# Altium project Cellar Watchdog.PrjPcb (part 4 of 4)

## Sheet Ethernet Controller.SchDoc: Ethernet Controller
size A3; Date: Dec. 29th, 2022; Author: Karl Asseily; DrawnBy: Karl Asseily; DocumentNumber: 202301222126; Revision: 1.2; SheetNumber: 17; SheetTotal: 20; Time: 23:00
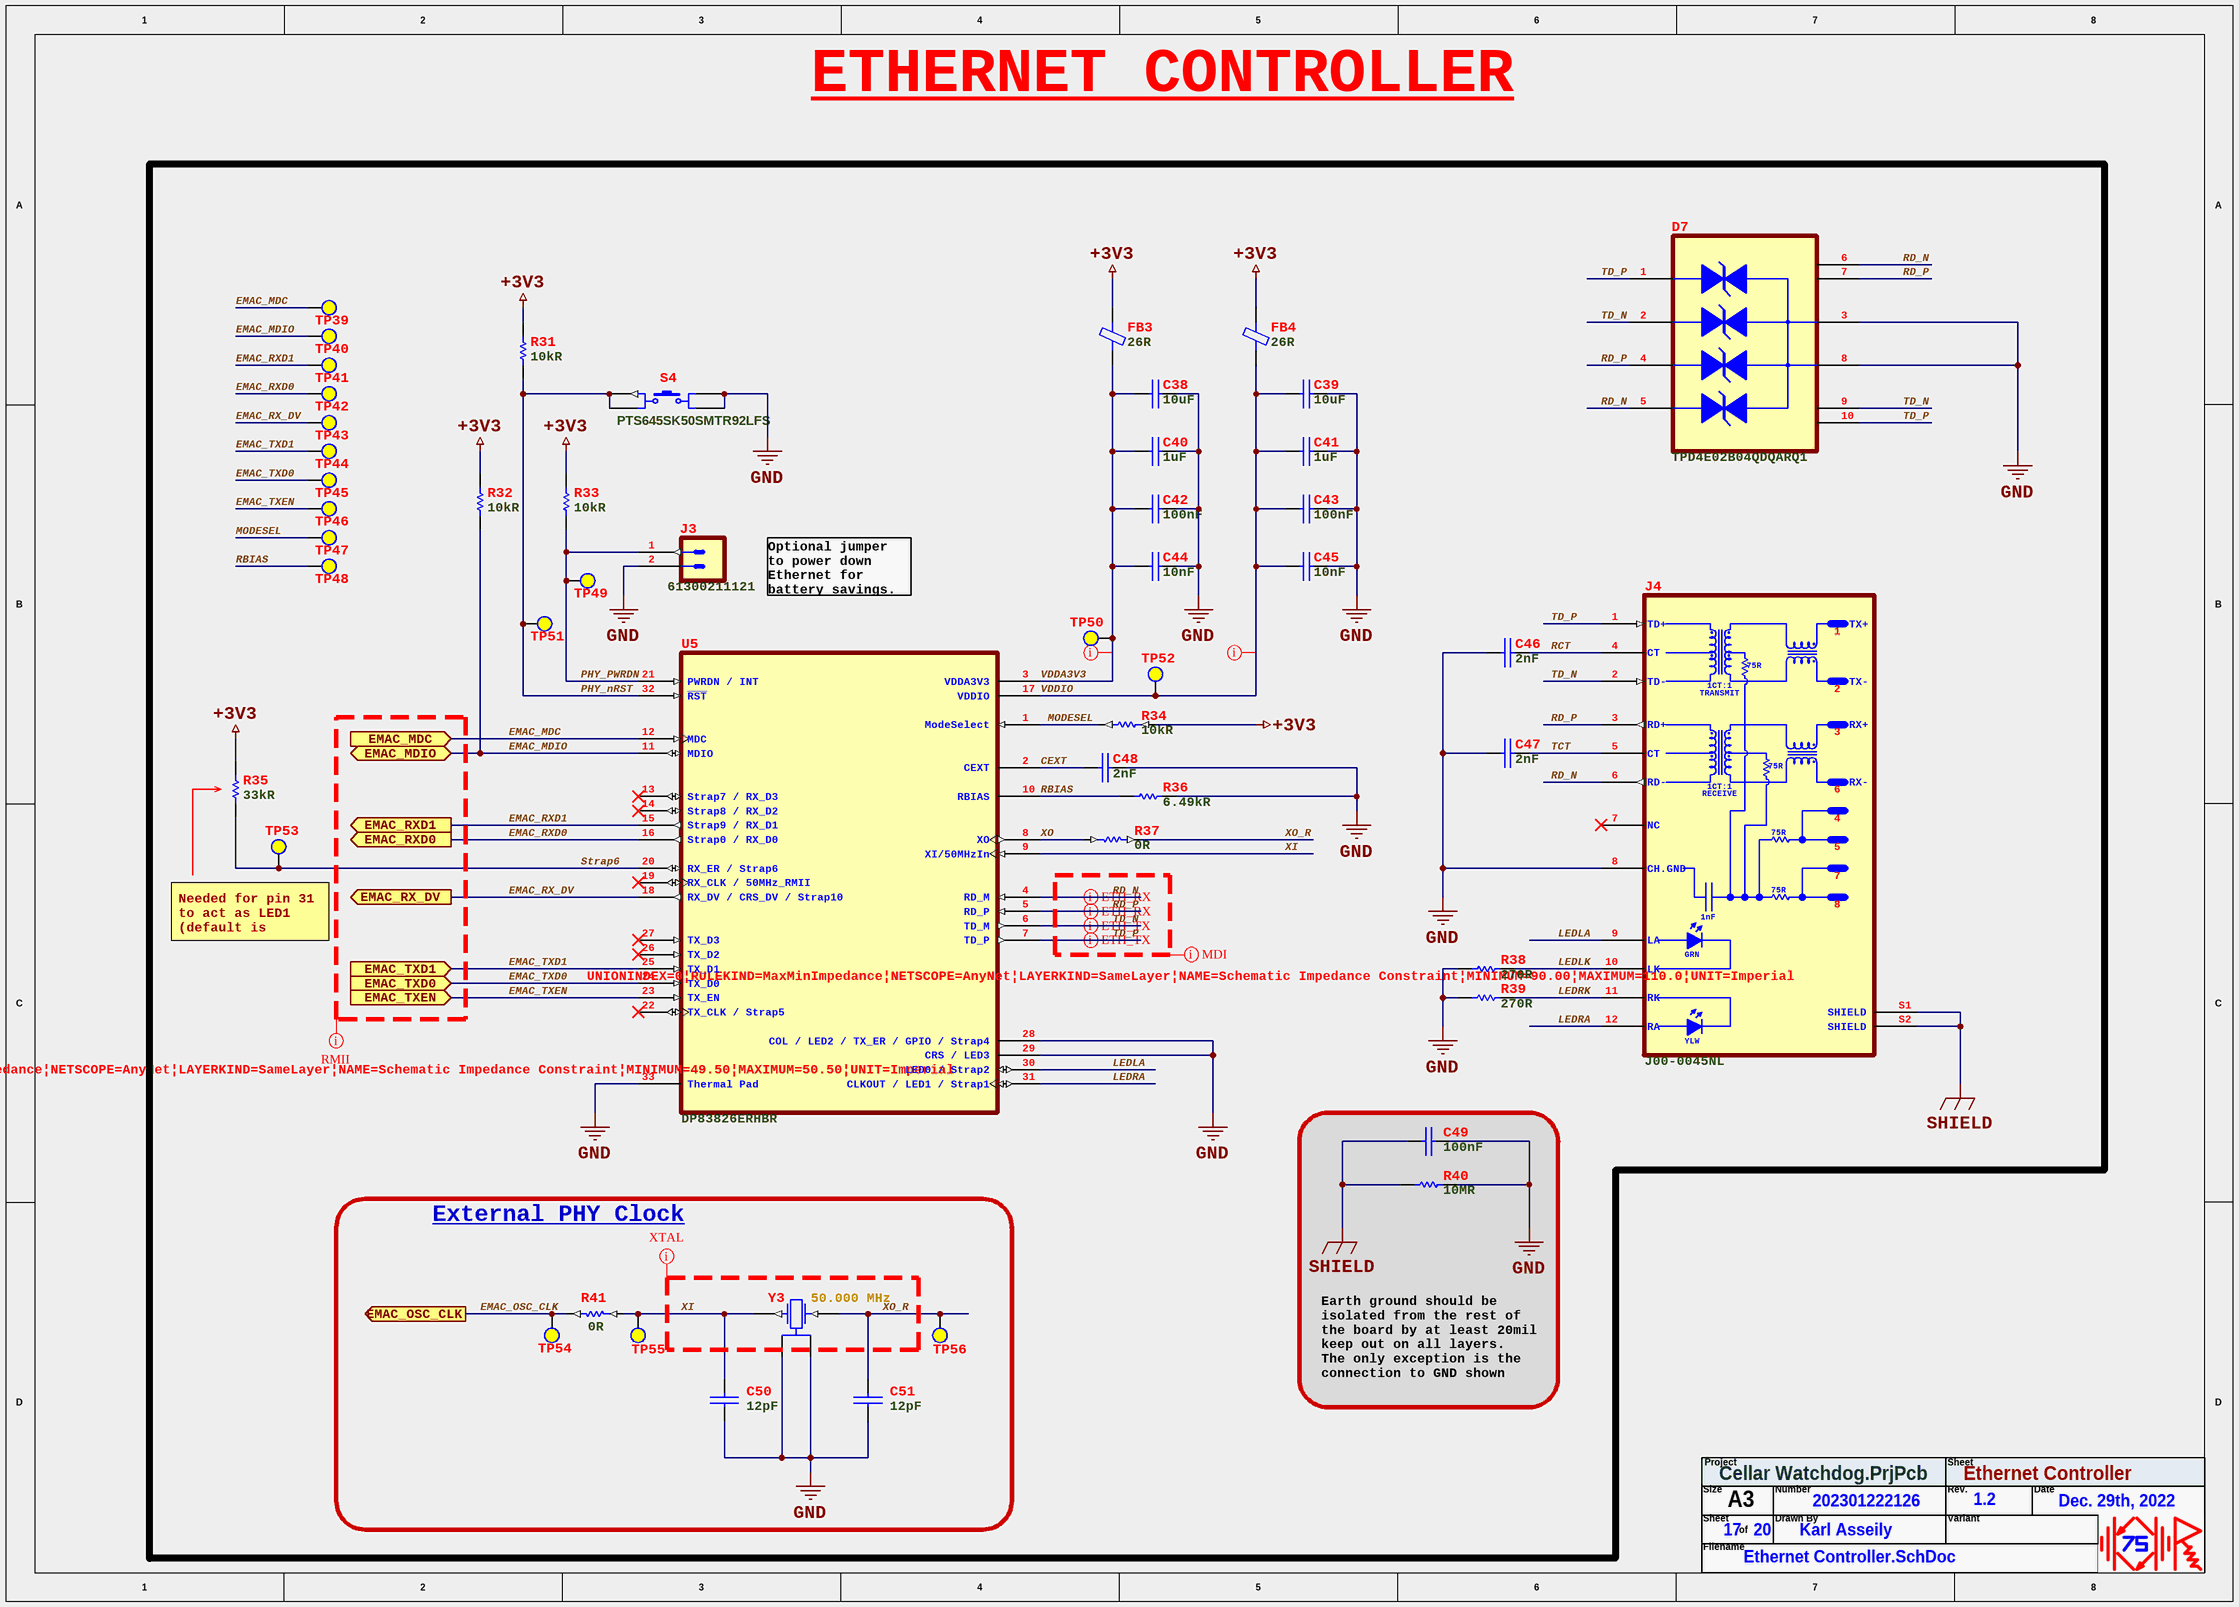
[diagram p18: Ethernet Controller.SchDoc]

### Parts
C38  10uF  [CAP_1206]
C39  10uF  [CAP_1206]
C40  1uF  [CAP_0805]
C41  1uF  [CAP_0805]
C42  100nF  [CAP_0603]
C43  100nF  [CAP_0603]
C44  10nF  [CAP_0603]
C45  10nF  [CAP_0603]
C46  2nF  [CAP_0603]
C47  2nF  [CAP_0603]
C48  2nF  [CAP_0603]
C49  100nF  [CAP_1206]
C50  12pF  [CAP_0603]
C51  12pF  [CAP_0603]
D7  TPD4E02B04QDQARQ1  [DIO-T-A_10-USON]
FB3  26R  [FB_0603]
FB4  26R  [FB_0603]
J3  61300211121  [CON_PLG_HDR-2x1-100]
J4  J00-0045NL  [CON-RCPT_RJ_PULSE_J00-0045NL]
R31  10kR  [RES_0603]
R32  10kR  [RES_0603]
R33  10kR  [RES_0603]
R34  10kR  [RES_0603]
R35  33kR  [RES_0603]
R36  6.49kR  [RES_0603]
R37  0R  [RES_0603]
R38  270R  [RES_0603]
R39  270R  [RES_0603]
R40  10MR  [RES_2512]
R41  0R  [RES_0603]
S4  PTS645SK50SMTR92LFS  [SW_TACTILE-SPST_PTS645SK50SMTR92LFS_SMD]
TP39  EMAC_MDC  [TEST POINT PAD]  (value not drawn)  (no BOM)
TP40  EMAC_MDIO  [TEST POINT PAD]  (value not drawn)  (no BOM)
TP41  EMAC_RXD1  [TEST POINT PAD]  (value not drawn)  (no BOM)
TP42  EMAC_RXD0  [TEST POINT PAD]  (value not drawn)  (no BOM)
TP43  EMAC_RX_DV  [TEST POINT PAD]  (value not drawn)  (no BOM)
TP44  EMAC_TXD1  [TEST POINT PAD]  (value not drawn)  (no BOM)
TP45  EMAC_TXD0  [TEST POINT PAD]  (value not drawn)  (no BOM)
TP46  EMAC_TXEN  [TEST POINT PAD]  (value not drawn)  (no BOM)
TP47  MODESEL  [TEST POINT PAD]  (value not drawn)  (no BOM)
TP48  RBIAS  [TEST POINT PAD]  (value not drawn)  (no BOM)
TP49  PHY_PWRDN  [TEST POINT PAD]  (value not drawn)  (no BOM)
TP50  VDDA3V3  [TEST POINT PAD]  (value not drawn)  (no BOM)
TP51  PHY_nRST  [TEST POINT HOLE]  (value not drawn)  (no BOM)
TP52  VDDIO  [TEST POINT PAD]  (value not drawn)  (no BOM)
TP53  Strap6  [TEST POINT PAD]  (value not drawn)  (no BOM)
TP54  EMAC_OSC_CLK  [TEST POINT PAD]  (value not drawn)  (no BOM)
TP55  50MHz IN EMAC  [TEST POINT HOLE]  (value not drawn)  (no BOM)
TP56  50MHz OUT EMAC  [TEST POINT HOLE]  (value not drawn)  (no BOM)
U5  DP83826ERHBR  [IC_QFN50P500X500X100-33N-D]
Y3  Frequency: 50.000 MHz  [XTAL_ECS-500-10-33-RTN-TR]  (hidden comment: ECS-500-10-33-RTN-TR)

### Blocks framed on the sheet
External PHY Clock: C50 C51 R41 TP54-TP56 Y3

### Ports
EMAC_MDC (in, see Cellar Watchdog, ESP32 Processor, Main Controller Unit), EMAC_MDIO (bidir, see Cellar Watchdog, ESP32 Processor, Main Controller Unit), EMAC_OSC_CLK (out, see Cellar Watchdog, ESP32 Processor, Main Controller Unit), EMAC_RX_DV (out, see Cellar Watchdog, ESP32 Processor, Main Controller Unit), EMAC_RXD0 (out, see Cellar Watchdog, ESP32 Processor, Main Controller Unit), EMAC_RXD1 (out, see Cellar Watchdog, ESP32 Processor, Main Controller Unit), EMAC_TXD0 (in, see Cellar Watchdog, ESP32 Processor, Main Controller Unit), EMAC_TXD1 (in, see Cellar Watchdog, ESP32 Processor, Main Controller Unit), EMAC_TXEN (in, see Cellar Watchdog, ESP32 Processor, Main Controller Unit)

### Nets
+3V3: FB3.2 FB4.2 R31.2 R32.2 R33.2 R34.2 R35.2
GND: C38.2 C39.2 C40.2 C41.2 C42.2 C43.2 C44.2 C45.2 C46.2 C47.2 C48.2 C49.2 C50.2 C51.2 D7.3(GND) D7.8(GND) J3.2 J4.8(CH.GND) R36.2 R38.2 R39.2 R40.2 S4.3 S4.4 U5.28(COL_/_LED2_/_TX_ER_/_GPIO_/_Strap4) U5.29(CRS_/_LED3) U5.33(Thermal_Pad) Y3.2(GND) Y3.4(GND)
SHIELD: C49.1 J4.S1(SHIELD) J4.S2(SHIELD) R40.1
CEXT: C48.1 U5.2(CEXT)
EMAC_MDC: TP39.TP U5.12(MDC) ; port EMAC_MDC
EMAC_MDIO: R32.1 TP40.TP U5.11(MDIO) ; port EMAC_MDIO
EMAC_OSC_CLK: R41.1 TP54.TP ; port EMAC_OSC_CLK
EMAC_RX_DV: TP43.TP U5.18(RX_DV_/_CRS_DV_/_Strap10) ; port EMAC_RX_DV
EMAC_RXD0: TP42.TP U5.16(Strap0_/_RX_D0) ; port EMAC_RXD0
EMAC_RXD1: TP41.TP U5.15(Strap9_/_RX_D1) ; port EMAC_RXD1
EMAC_TXD0: TP45.TP U5.24(TX_D0) ; port EMAC_TXD0
EMAC_TXD1: TP44.TP U5.25(TX_D1) ; port EMAC_TXD1
EMAC_TXEN: TP46.TP U5.23(TX_EN) ; port EMAC_TXEN
LEDLA: J4.9(LA) U5.30(LED0_/_Strap2)
LEDLK: J4.10(LK) R38.1
LEDRA: J4.12(RA) U5.31(CLKOUT_/_LED1_/_Strap1)
LEDRK: J4.11(RK) R39.1
MODESEL: R34.1 TP47.TP U5.1(ModeSelect)
PHY_nRST: R31.1 S4.1 S4.2 TP51.TP U5.32(~{RST})
PHY_PWRDN: J3.1 R33.1 TP49.TP U5.21(PWRDN_/_INT)
RBIAS: R36.1 TP48.TP U5.10(RBIAS)
RCT: C46.1 J4.4(CT)
RD_N: D7.5(IO4) D7.6(NC) J4.6(RD-) U5.4(RD_M)
RD_P: D7.4(IO3) D7.7(NC) J4.3(RD+) U5.5(RD_P)
Strap6: R35.1 TP53.TP U5.20(RX_ER_/_Strap6)
TCT: C47.1 J4.5(CT)
TD_N: D7.2(IO2) D7.9(NC) J4.2(TD-) U5.6(TD_M)
TD_P: D7.1(IO1) D7.10(NC) J4.1(TD+) U5.7(TD_P)
VDDA3V3: C38.1 C40.1 C42.1 C44.1 FB3.1 TP50.TP U5.3(VDDA3V3)
VDDIO: C39.1 C41.1 C43.1 C45.1 FB4.1 TP52.TP U5.17(VDDIO)
XI: C50.1 R41.2 TP55.TP U5.9(XI/50MHzIn) Y3.1(In/Out)
XO: R37.1 U5.8(XO)
XO_R: C51.1 R37.2 TP56.TP Y3.3(Out/In)

Not connected (* = marked no-connect by the designer): J4 7(NC)*; U5 13(Strap7_/_RX_D3)* 14(Strap8_/_RX_D2)* 19(RX_CLK_/_50MHz_RMII)* 22(TX_CLK_/_Strap5)* 26(TX_D2)* 27(TX_D3)*

### Layout directives
differential pair; differential pair class EMAC_TD: TD_N, TD_P
differential pair; differential pair class EMAC_RD: RD_N, RD_P
net class ETH_MDI; rule Impedance Constraint [Min = 90.00    Max = 110.0    ]; rule Matched Net Lengths [Delay Tolerance = 5ps]; rule Length Constraint [Min Length = 0mil    Max Length = 2000mil]: RD_N, RD_P, TD_N, TD_P
net class ETH_RMII; rule Impedance Constraint [Min = 49.50    Max = 50.50    ]; rule Matched Net Lengths [Delay Tolerance = 5ps]; rule Length Constraint [Min Length = 0mil    Max Length = 6000mil]: (no net found under the mark)
net class XTAL; rule Maximum Via Count Constraint [Max Count = 0]: XI, XO_R
net class POWER; rule Supply Nets [Voltage = 3.300]: VDDA3V3, VDDIO

### Notes on the sheet
- ETHERNET CONTROLLER
- Optional jumper to power down Ethernet for battery savings.
- (near TP53) Needed for pin 31 to act as LED1 (default is CLKOUT)
- Earth ground should be isolated from the rest of the board by at least 20mil keep out on all layers.
  The only exception is the connection to GND shown above.
- Project
- Sheet
- Size
- Filename
- A3
- of
- Number
- Drawn By
- Rev.
- Variant
- Date
- (in symbol CON-RCPT_RJ_J00-0045NL) TX+; 75R; TX-; 1CT:1; TRANSMIT; RX+; RX-; RECEIVE; 1nF; GRN; YLW

### Library data of the parts
C38 C39 = CAP_10uF-25V-10%_1206: 10 µF ±10% 25V Ceramic Capacitor X7R 1206 (3216 Metric); Manufacturer: Yageo; Manufacturer Part Number: CC1206KKX7R8BB106; Supplier 1: Digi-Key; RoHS: Yes; Category: Ceramic Capacitors; Stock 1: 67513; Pricing 1: 1=0.51000, 10=0.35100, 50=0.24580, 100=0.21070, 500=0.15806, 1000=0.13347 (USD); Mounting Technology: Surface Mount; Case/Package: 1206; Case Code (Imperial): 1206; Case Code (Metric): 3216; Weight: 0.000571oz; Min Operating Temperature: -55°C; Max Operating Temperature: 125°C; Capacitance: 10uF; Tolerance: 10%; Dielectric: X7R; Packaging: Tape and Reel; Voltage Rating (DC): 25V; Voltage Rating: 25V; Termination: SMD/SMT; Resistor Type: Ceramic; Series: CC; Construction: Flat; Length: 3.2mm; Width: 1.6mm; Depth: 1.6mm; Thickness: 0.071inch; Radiation Hardening: No; Lead Free: Lead Free; Halogen Free: Halogen Free; RoHS Compliant: Yes; Supplier 2: Mouser; ComponentLink1Description: Datasheet; ComponentLink1URL: C:\Users\Public\Documents\Altium\Projects\Cellar_Watchdog\Docs\Capacitor\UPY-GPHC_X7R_6.3V-to-250V_22.pdf; Supplier Part Number 1: 311-1959-1-ND; Supplier Part Number 2: 603-CC126KKX7R8BB106
C40 C41 = CAP_1uF-16V-10%_0603: as C52-C54 on sheet LCD Display; Supplier 1: Digi-Key; RoHS: Yes; Category: Ceramic Capacitors; Stock 1: 10491943; Pricing 1: 1=0.14000, 10=0.09800, 50=0.05560, 100=0.04610, 500=0.03234, 1000=0.02678 (USD); Mounting Technology: Surface Mount; Case/Package: 0603; Pins: 2; Case Code (Metric): 1608; Case Code (Imperial): 0603; Min Operating Temperature: -55°C; Max Operating Temperature: 125°C; Capacitance: 1uF; Tolerance: 10%; Dielectric: X7R; Voltage Rating: 16V; Package Quantity: 1; Packaging: Tape and Reel; Voltage Rating (DC): 16V; Termination: SMD/SMT; Resistor Type: Ceramic; Voltage: 16V; Series: CC; Construction: Flat; Length: 1.6mm; Width: 0.031inch; Height: 0.8mm; Thickness: 0.035inch; Depth: 0.8mm; Radiation Hardening: No; Lead Free: Lead Free; Halogen Free: Halogen Free; RoHS Compliant: Yes; ComponentLink1URL: C:\Users\Public\Documents\Altium\Projects\Cellar_Watchdog\Docs\Capacitor\UPY-GPHC_X7R_6.3V-to-250V_22.pdf; ComponentLink1Description: Datasheet; Supplier 2: Mouser; Supplier Part Number 1: 311-1446-1-ND; Supplier Part Number 2: 603-CC603KRX7R7BB105
C42 C43 = CAP_0.1uF-50V-10%_0603: as C55-C59 on sheet LCD Display; Supplier 1: Digi-Key; RoHS: Yes; Category: Ceramic Capacitors; Stock 1: 10054527; Pricing 1: 1=0.10000, 10=0.05400, 50=0.02960, 100=0.02430, 500=0.01732, 1000=0.01361 (USD); Mounting Technology: Surface Mount; Case/Package: 0603; Pins: 2; Case Code (Metric): 1608; Case Code (Imperial): 0603; Dielectric Material: Ceramic; Min Operating Temperature: -55°C; Max Operating Temperature: 125°C; Package Quantity: 1; Capacitance: 100nF; Voltage Rating: 50V; Tolerance: 10%; Packaging: Tape and Reel; Dielectric: X7R; Termination: SMD/SMT; Voltage: 50V; Series: CC; Length: 0.063inch; Width: 0.031inch; Height: 0.8mm; Thickness: 0.035inch; Depth: 0.8mm; Radiation Hardening: No; Reach SVHC Compliant: Yes; Lead Free: Lead Free; Halogen Free: Halogen Free; RoHS Compliant: Yes; ComponentLink1URL: C:\Users\Public\Documents\Altium\Projects\Cellar_Watchdog\Docs\Capacitor\UPY-GPHC_X7R_6.3V-to-250V_22.pdf; ComponentLink1Description: Datasheet; Supplier Part Number 2: 603-CC603KRX7R9BB104; Supplier Part Number 1: 311-1344-1-ND; Supplier 2: Mouser
C44 C45 = CAP_10nF-50V-10%_0603: 10000 pF ±10% 50V Ceramic Capacitor X7R 0603 (1608 Metric); Manufacturer: Yageo; Manufacturer Part Number: CC0603KRX7R9BB103; Insulation Resistance: 100GR; Supplier 1: Digi-Key; RoHS: Yes; Category: Ceramic Capacitors; Stock 1: 8015125; Pricing 1: 1=0.10000, 10=0.03200, 50=0.01760, 100=0.01440, 500=0.01026, 1000=0.00805 (USD); Mounting Technology: Surface Mount; Case/Package: 0603; Pins: 2; Material: Ceramic; Case Code (Metric): 1608; Case Code (Imperial): 0603; Min Operating Temperature: -55°C; Max Operating Temperature: 125°C; Tolerance: 10%; Capacitance: 10nF; Dielectric: X7R; Voltage: 50V; Packaging: Tape and Reel; Voltage Rating: 50V; Voltage Rating (DC): 50V; Package Quantity: 1; Termination: SMD/SMT; Resistor Type: Ceramic; Series: CC; Length: 1.6mm; Width: 0.031inch; Height: 0.8mm; Thickness: 0.035inch; Depth: 0.8mm; Radiation Hardening: No; RoHS Compliant: Yes; Lead Free: Lead Free; Halogen Free: Halogen Free; ComponentLink1URL: C:\Users\Public\Documents\Altium\Projects\Cellar_Watchdog\Docs\Capacitor\UPY-GPHC_X7R_6.3V-to-250V_22.pdf; ComponentLink1Description: Datasheet; Supplier 2: Mouser; Supplier Part Number 1: 311-1085-1-ND; Supplier Part Number 2: 603-CC603KRX7R9BB103
C46-C48 = CAP_2nF-50V-10%_0603: 2000 pF ±10% 50V Ceramic Capacitor X7R 0603 (1608 Metric); Manufacturer: Yageo; Manufacturer Part Number: CC0603KRX7R9BB202; Supplier 1: Digi-Key; RoHS: Yes; Category: Ceramic Capacitors; Stock 1: 23619; Pricing 1: 1=0.10000, 10=0.06100, 50=0.03320, 100=0.02710, 500=0.01934, 1000=0.01519 (USD); Mounting Technology: Surface Mount; Case/Package: 0603; Case Code (Imperial): 0603; Case Code (Metric): 1608; Weight: 7.1E-05oz; Min Operating Temperature: -55°C; Max Operating Temperature: 125°C; Packaging: Tape and Reel; Capacitance: 2nF; Voltage Rating (DC): 50V; Tolerance: 10%; Voltage Rating: 50V; Dielectric: X7R; Termination: SMD/SMT; Resistor Type: Ceramic; Series: CC; Length: 0.063inch; Width: 0.031inch; Thickness: 0.035inch; Depth: 0.8mm; Lead Free: Lead Free; Halogen Free: Halogen Free; ComponentLink1URL: C:\Users\Public\Documents\Altium\Projects\Cellar_Watchdog\Docs\Capacitor\UPY-GPHC_X7R_6.3V-to-250V_22.pdf; ComponentLink1Description: Datasheet; Supplier 2: Mouser; Supplier Part Number 1: 311-4098-1-ND; Supplier Part Number 2: 603-CC603KRX7R9BB202
C49 = CAP_0.1uF-100V-5%_1206: 0.1 µF ±5% 100V Ceramic Capacitor X7R 1206 (3216 Metric); Manufacturer: Yageo; Manufacturer Part Number: CC1206JKX7R0BB104; Supplier 1: Digi-Key; RoHS: Yes; Category: Ceramic Capacitors; Stock 1: 36526; Pricing 1: 1=0.27000, 10=0.18300, 50=0.12220, 100=0.10380, 500=0.07328, 1000=0.06412 (USD); Mounting Technology: Surface Mount; Case/Package: 1206; Case Code (Imperial): 1206; Case Code (Metric): 3216; Weight: 0.000571oz; Min Operating Temperature: -55°C; Max Operating Temperature: 125°C; Capacitance: 100nF; Tolerance: 5%; Packaging: Tape and Reel; Voltage Rating (DC): 100V; Voltage Rating: 100V; Dielectric: X7R; Termination: SMD/SMT; Resistor Type: Ceramic; Series: CC; Construction: Flat; Length: 3.2mm; Width: 0.063inch; Height: 1.25mm; Thickness: 0.057inch; Depth: 1.6mm; Radiation Hardening: No; Lead Free: Lead Free; RoHS Compliant: Yes; ComponentLink1URL: C:\Users\Public\Documents\Altium\Projects\Cellar_Watchdog\Docs\Capacitor\UPY-GPHC_X7R_6.3V-to-250V_22.pdf; ComponentLink1Description: Datasheet; Supplier 2: Mouser; Supplier Part Number 1: 311-3557-1-ND; Supplier Part Number 2: 603-CC126JKX7R0BB104
C50 C51 = CAP_12pf-50V-5%_0603: 12 pF ±5% 50V Ceramic Capacitor C0G, NP0 0603 (1608 Metric); Manufacturer: Yageo; Manufacturer Part Number: CC0603JRNPO9BN120; Insulation Resistance: 100GR; Supplier 1: Digi-Key; RoHS: Yes; Category: Ceramic Capacitors; Stock 1: 152407; Pricing 1: 1=0.10000, 10=0.05100, 50=0.02800, 100=0.02280, 500=0.01630, 1000=0.01280 (USD); Mounting Technology: Surface Mount; Case/Package: 0603; Pins: 2; Case Code (Metric): 1608; Case Code (Imperial): 0603; Dielectric Material: Ceramic; Min Operating Temperature: -55°C; Max Operating Temperature: 125°C; Package Quantity: 1; Capacitance: 12pF; Voltage Rating: 50V; Tolerance: 5%; Packaging: Tape and Reel; Voltage Rating (DC): 50V; Dielectric: C0G; Termination: SMD/SMT; Resistor Type: Ceramic; Series: CC; Length: 1.6mm; Width: 0.031inch; Height: 0.8mm; Thickness: 0.035inch; Depth: 0.8mm; Radiation Hardening: No; Reach SVHC Compliant: Yes; Lead Free: Lead Free; RoHS Compliant: Yes; ComponentLink7URL: C:\Users\Public\Documents\Altium\Projects\Cellar_Watchdog\Docs\Capacitor\UPY-GP_NP0_16V-to-50V_18.pdf; ComponentLink7Description: Datasheet; Supplier 2: Mouser; Supplier Part Number 1: 311-1059-1-ND; Supplier Part Number 2: 603-CC603JRNPO9BN120
D7 = DIO-T-A-BI_5.5V-8.8V-2A_10-USON: 8.8V Clamp 2A (8/20µs) Ipp Tvs Diode Surface Mount 10-USON (2.5x1); Manufacturer: Texas Instruments; Interface: LVDS,USB,Ethernet,HDMI; Number of Channels: 4; Reverse Standoff Voltage: 3.6V; Min Breakdown Voltage: 5.5V; Peak Pulse Power: 17W; Power Line Protection: No; Supplier 1: Digi-Key; Manufacturer Part Number: TPD4E02B04QDQARQ1; RoHS: Yes; Category: Integrated Circuits (ICs); Stock 1: 82049; Pricing 1: 1=0.72000, 10=0.63700, 100=0.48810, 500=0.38584, 1000=0.30867 (USD); Mount: Surface Mount; Number of Pins: 10; Min Operating Temperature: -40°C; Max Operating Temperature: 125°C; Resistor Type: Zener; Packaging: Tape and Reel; Number of Bidirectional Channels: 4; Clamping Voltage: 8.8V; Peak Pulse Current: 2A; RoHS Compliant: Yes; ComponentLink1URL: C:\Users\Public\Documents\Altium\Projects\Cellar_Watchdog\Docs\Diode\tpd4e02b04-q1.pdf; ComponentLink1Description: Datasheet; Supplier 2: Mouser; Supplier Part Number 1: 296-48995-1-ND; Supplier Part Number 2: 595-D4E02B04QDQARQ1
FB3 FB4 = FB_26R-100MHz-6A_0603: 26 Ohms @ 100 MHz 1 Power Line Ferrite Bead 0603 (1608 Metric) 6A 7mOhm; Manufacturer: Murata; Manufacturer Part Number: BLM18SG260TZ1D; Supplier 1: Mouser; RoHS: Yes; Category: Ferrite Beads and Chips; Stock 1: 1330; Pricing 1: 1=0.14000, 10=0.11300, 50=0.11300, 100=0.06300, 1000=0.03800, 10000=0.03400 (USD); RoHS Compliant: Yes; ComponentLink1URL: C:\Users\Public\Documents\Altium\Projects\Cellar_Watchdog\Docs\Ferrite Bead\QNFA9122.pdf; ComponentLink1Description: Datasheet; Supplier Part Number 1: 81-BLM18SG260TZ1D; Impedance: 26R
J3 = CON-PLG-HDR_2x1-100-ST_TH: Connector Header Through Hole 2 position 0.100" (2.54mm); Manufacturer: Wurth Electronics; Current Rating: 3A; Voltage Rating: 250V; Number of Positions: 2; Gender: Male; Connector Type: Male Pin; Pitch: 0.1inch; Supplier 1: Digi-Key; Manufacturer Part Number: 61300211121; RoHS: Yes; Category: Headers and Wire Housings; Stock 1: 266203; Pricing 1: 1=0.13000, 10=0.11300, 25=0.09400, 50=0.07900, 100=0.07100, 1000=0.06500 (USD); Mounting Technology: Through Hole; Contact Plating: Gold; Housing Material: PBT; Contact Material: Copper Alloy,Copper; Color: Black; Min Operating Temperature: -40°C; Max Operating Temperature: 125°C; Number of Rows: 1; Contact Gender: Male; Packaging: Bulk; Termination: Through Hole; Number of Contacts: 2; Series: WR-PHD; Contact Type: Male Pin; Contact Mating Length: 0.236inch; Lead Free: Lead Free; RoHS Compliant: Yes; ComponentLink1URL: C:\Users\Public\Documents\Altium\Projects\Cellar_Watchdog\Docs\Connector\6130xx11121.pdf; ComponentLink1Description: Datasheet; Supplier 2: Mouser; Supplier Part Number 1: 732-5315-ND; Supplier Part Number 2: 710-61300211121
J4 = CON-RCPT_RJ_J00-0045NL: 1 Port RJ45 Through Hole 10/100 Base-TX, AutoMDIX; Manufacturer: Pulse; Number of Ports: 1; Number of Positions Loaded: 8; Pitch: 2.54mm; Supplier 1: Digi-Key; Manufacturer Part Number: J00-0045NL; RoHS: Yes; Category: Modular / Ethernet Connectors; Stock 1: 10543; Pricing 1: 1=6.57000, 10=5.94100, 25=5.61200, 50=5.47540, 100=5.20150, 250=4.65400, 500=4.38024, 1000=3.83272, 2500=3.64108 (USD); Number of Pins: 8; Contact Material: Bronze; Contact Plating: Gold; Housing Material: Thermoplastic; Min Operating Temperature: 0°C; Max Operating Temperature: 70°C; Orientation: Right Angle; Packaging: Rail/Tube; Length: 16.26mm; Depth: 21.59mm; Lead Free: Lead Free; RoHS Compliant: Yes; Supplier 2: Mouser; Supplier Part Number 1: 553-1619-5-ND; Supplier Part Number 2: 673-J00-0045NL; ComponentLink2Description: Datasheet; ComponentLink2URL: C:\Users\Public\Documents\Altium\Projects\Cellar_Watchdog\Docs\Connector\J00_Series_Rev_Mar2019.pdf
R31-R34 = RES_10kR-100mW-1%_0603: 10 kOhms ±1% 0.1W, 1/10W Chip Resistor 0603 (1608 Metric) Moisture Resistant Thick Film; Manufacturer: Yageo; Manufacturer Part Number: RC0603FR-0710KL; Temperature Coefficient: 100ppm/°C; Voltage Rating (DC): 50V; Power Rating: 100mW; Voltage Rating: 75V; Supplier 1: Digi-Key; RoHS: Yes; Category: Chip SMD Resistors; Stock 1: 43209622; Pricing 1: 1=0.10000, 10=0.02100, 100=0.00850, 1000=0.00383, 2500=0.00332 (USD); Case/Package: 0603; Pins: 2; Case Code (Imperial): 0603; Case Code (Metric): 1608; Weight: 7.1E-05oz; Min Operating Temperature: -55°C; Max Operating Temperature: 155°C; Tolerance: 1%; Resistor Type: Thick Film; Resistance: 10kR; Packaging: Tape and Reel; Termination: SMD/SMT; Features: Moisture Resistant; Series: RC; Max Power Dissipation: 100mW; Number of Terminations: 2; Resistance Tolerance: 1%; Construction: Rectangular; Length: 1.6mm; Width: 0.8mm; Height: 0.45mm; Depth: 0.8mm; Lead Pitch: 0.3mm; Reach SVHC Compliant: Yes; Lead Free: Lead Free; Military Standard: Not; RoHS Compliant: Yes; ComponentLink6URL: C:\Users\Public\Documents\Altium\Projects\Cellar_Watchdog\Docs\Resistor\PYu-RC_Group_51_RoHS_L_12.pdf; ComponentLink6Description: Datasheet; Supplier 2: Mouser; Supplier Part Number 1: 311-10.0KHRCT-ND; Supplier Part Number 2: 603-RC0603FR-0710KL
R35 = RES_33kR-100mW-1%_0603: 33 kOhms ±1% 0.1W, 1/10W Chip Resistor 0603 (1608 Metric) Moisture Resistant Thick Film; Manufacturer: Yageo; Manufacturer Part Number: RC0603FR-0733KL; Voltage Rating (DC): 50V; Temperature Coefficient: 100ppm/°C; Power Rating: 100mW; Supplier 1: Digi-Key; RoHS: Yes; Category: Chip SMD Resistors; Stock 1: 663847; Pricing 1: 1=0.10000, 10=0.01900, 100=0.00770, 1000=0.00345, 2500=0.00300 (USD); Case/Package: 0603; Pins: 2; Case Code (Imperial): 0603; Case Code (Metric): 1608; Min Operating Temperature: -55°C; Max Operating Temperature: 155°C; Resistance: 33kR; Tolerance: 1%; Packaging: Tape and Reel; Resistor Type: Thick Film; Voltage Rating: 50V; Package Quantity: 1; Termination: SMD/SMT; Number of Terminations: 2; Max Power Dissipation: 100mW; Features: Moisture Resistant; Series: RC; Resistance Tolerance: 1%; Construction: Rectangular; Length: 0.063inch; Width: 0.031inch; Height: 0.022inch; Depth: 0.8mm; Reach SVHC Compliant: Yes; Lead Free: Lead Free; Military Standard: Not; RoHS Compliant: Yes; ComponentLink1URL: C:\Users\Public\Documents\Altium\Projects\Cellar_Watchdog\Docs\Resistor\PYu-RC_Group_51_RoHS_L_12.pdf; ComponentLink1Description: Datasheet; Supplier 2: Mouser; Supplier Part Number 1: 311-33.0KHRCT-ND; Supplier Part Number 2: 603-RC0603FR-0733KL
R36 = RES_6.49kR-100mW-1%_0603: 6.49 kOhms ±1% 0.1W, 1/10W Chip Resistor 0603 (1608 Metric) Moisture Resistant Thick Film; Manufacturer: Yageo; Manufacturer Part Number: RC0603FR-076K49L; Power Rating: 100mW; Voltage Rating: 50V; Temperature Coefficient: 100ppm/°C; Supplier 1: Digi-Key; RoHS: Yes; Category: Chip SMD Resistors; Stock 1: 369365; Pricing 1: 1=0.10000, 10=0.02100, 100=0.00850, 1000=0.00383, 2500=0.00332 (USD); Mounting Technology: Surface Mount; Case/Package: 0603; Case Code (Imperial): 0603; Case Code (Metric): 1608; Min Operating Temperature: -55°C; Max Operating Temperature: 155°C; Tolerance: 1%; Packaging: Tape and Reel; Resistance: 6.49kR; Package Quantity: 1; Termination: SMD/SMT; Resistor Type: Thick Film; Number of Terminations: 2; Max Power Dissipation: 100mW; Voltage Rating (DC): 50V; Features: Moisture Resistant; Series: RC; Construction: Rectangular; Technology: THICK FILM; Length: 1.6mm; Width: 0.031inch; Height: 0.022inch; Depth: 0.8mm; RoHS Compliant: Yes; Military Standard: Not; Lead Free: Lead Free; ComponentLink1URL: C:\Users\Public\Documents\Altium\Projects\Cellar_Watchdog\Docs\Resistor\PYu-RC_Group_51_RoHS_L_12.pdf; ComponentLink1Description: Datasheet; Supplier 2: Mouser; Supplier Part Number 1: 311-6.49KHRCT-ND; Supplier Part Number 2: 603-RC0603FR-076K49L
R37 R41 = RES_0R-100mW-1%_0603: 0 Ohms Jumper Chip Resistor 0603 (1608 Metric) Moisture Resistant Thick Film; Manufacturer: Yageo; Manufacturer Part Number: RC0603FR-070RL; Power Rating: 100mW; Tolerance: 1%; Voltage Rating (DC): 50V; Temperature Coefficient: 200ppm/°C; Current Rating: 1A; Working Voltage: 75V; Supplier 1: Digi-Key; RoHS: Yes; Category: Chip SMD Resistors; Stock 1: 4158752; Pricing 1: 1=0.10000, 10=0.01800, 25=0.01320, 50=0.01000, 100=0.00730, 250=0.00560, 500=0.00448, 1000=0.00329 (USD); Case/Package: 0603; Number of Pins: 2; Contact Plating: Tin,Matte; Case Code (Metric): 1608; Case Code (Imperial): 0603; Min Operating Temperature: -55°C; Max Operating Temperature: 155°C; Resistance: 0R; Packaging: Tape and Reel; Resistor Type: Thick Film; Package Quantity: 5000; Voltage Rating: 50V; Number of Terminations: 2; Termination: SMD/SMT; Max Power Dissipation: 100mW; Features: Moisture Resistant; Series: RC; Construction: Rectangular; Resistance Tolerance: 1%; Technology: THICK FILM; Length: 1.6mm; Width: 0.8mm; Height: 0.45mm; Depth: 0.8mm; Radiation Hardening: No; Reach SVHC Compliant: Yes; Lead Free: Lead Free; RoHS Compliant: Yes; Military Standard: Not; ComponentLink7URL: C:\Users\Public\Documents\Altium\Projects\Cellar_Watchdog\Docs\Resistor\PYu-RC_Group_51_RoHS_L_12.pdf; ComponentLink7Description: Datasheet; Supplier 2: Mouser; Supplier Part Number 2: 603-RC0603FR-070RL; Supplier Part Number 1: 311-0.0HRCT-ND
R38 R39 = RES_270R-100mW-1%_0603: 270 Ohms ±1% 0.1W, 1/10W Chip Resistor 0603 (1608 Metric) Moisture Resistant Thick Film; Manufacturer: Yageo; Manufacturer Part Number: RC0603FR-07270RL; Power Rating: 100mW; Voltage Rating: 50V; Temperature Coefficient: 100ppm/°C; Supplier 1: Digi-Key; RoHS: Yes; Category: Chip SMD Resistors; Stock 1: 697012; Pricing 1: 1=0.10000, 10=0.02100, 100=0.00850, 1000=0.00383, 2500=0.00332 (USD); Case/Package: 0603; Pins: 2; Case Code (Imperial): 0603; Case Code (Metric): 1608; Min Operating Temperature: -55°C; Max Operating Temperature: 155°C; Resistance: 270R; Tolerance: 1%; Packaging: Tape and Reel; Voltage Rating (DC): 50V; Package Quantity: 5000; Termination: SMD/SMT; Resistor Type: Thick Film; Number of Terminations: 2; Max Power Dissipation: 100mW; Features: Moisture Resistant; Series: RC; Resistance Tolerance: 1%; Technology: THICK FILM; Construction: Rectangular; Length: 0.063inch; Width: 0.031inch; Height: 0.022inch; Depth: 0.8mm; RoHS Compliant: Yes; Military Standard: Not; Lead Free: Lead Free; ComponentLink1URL: C:\Users\Public\Documents\Altium\Projects\Cellar_Watchdog\Docs\Resistor\PYu-RC_Group_51_RoHS_L_12.pdf; ComponentLink1Description: Datasheet; Supplier 2: Mouser; Supplier Part Number 2: 603-RC0603FR-07270RL; Supplier Part Number 1: 311-270HRCT-ND
R40 = RES_10MR-1W-1%_2512: 10 MOhms ±1% 1W Chip Resistor 2512 (6432 Metric) Moisture Resistant Thick Film; Manufacturer: Yageo; Manufacturer Part Number: RC2512FK-0710ML; Temperature Coefficient: 100ppm/°C; Supplier 1: Digi-Key; RoHS: Yes; Category: Chip SMD Resistors; Stock 1: 9688; Pricing 1: 1=0.41000, 10=0.29400, 100=0.11740, 1000=0.05786 (USD); Case/Package: 2512; Min Operating Temperature: -55°C; Max Operating Temperature: 155°C; Resistance: 10MR; Tolerance: 1%; Packaging: Tape and Reel; Resistor Type: Thick Film; Features: Moisture Resistant; Power Rating: 1W; Max Power Dissipation: 1W; Number of Terminations: 2; Length: 0.25inch; Width: 0.122inch; Height: 0.026inch; Depth: 3.1mm; Military Standard: Not; ComponentLink1URL: C:\Users\Public\Documents\Altium\Projects\Cellar_Watchdog\Docs\Resistor\PYu-RC_Group_51_RoHS_L_12.pdf; ComponentLink1Description: Datasheet; Supplier 2: Mouser; Supplier Part Number 1: 13-RC2512FK-0710MLCT-ND; Supplier Part Number 2: 603-RC2512FK-0710ML
S4 = SW4-NO-SPST_PTS645SK50SMTR92LFS_SMD: Tactile Switch SPST-NO Top Actuated Surface Mount; Manufacturer: ITT C&K; Mechanical Life: 100000Cycles; Actuator Material: Nylon,Polyamide,PA66; Operating Force: 260gf; Throw Configuration: SPST; Max Voltage Rating (DC): 12V; Current Rating: 50mA; Contact Resistance: 100mR; Illumination Type: Non-Illuminated,Illuminated; Switch Function: Off-Mom; Actuator Type: Standard; Actuator Length: 1.55mm; Supplier 1: Digi-Key; Manufacturer Part Number: PTS645SK50SMTR92LFS; RoHS: Yes; Category: Tactile Switches; Stock 1: 267139; Pricing 1: 1=0.26000, 10=0.25100, 25=0.23840, 100=0.21580, 250=0.19676, 500=0.18288 (USD); Mount: Surface Mount; Case/Package: SMD/SMT; Contact Plating: Silver; Contact Material: Bronze; Color: Red; Min Operating Temperature: -20°C; Max Operating Temperature: 60°C; Packaging: Tape and Reel; Termination: Gull Wing; Voltage Rating (DC): 12V; Package Quantity: 1; Max Current Rating: 50mA; Orientation: Straight; Series: PTS645; Length: 6mm; Depth: 9mm; REACH SVHC: No SVHC; Lead Free: Lead Free; RoHS Compliant: Yes; ComponentLink1URL: C:\Users\Public\Documents\Altium\Projects\Cellar_Watchdog\Docs\Switch\pts645.pdf; ComponentLink1Description: Datasheet; Supplier 2: Mouser; Supplier Part Number 1: CKN9087CT-ND; Supplier Part Number 2: 611-PTS645SK50SMTR92
TP39-TP56 = Test Point: PCB Test Point; ClassName: Test Point
  TP39: Value: EMAC_MDC
  TP40: Value: EMAC_MDIO
  TP41: Value: EMAC_RXD1
  TP42: Value: EMAC_RXD0
  TP43: Value: EMAC_RX_DV
  TP44: Value: EMAC_TXD1
  TP45: Value: EMAC_TXD0
  TP46: Value: EMAC_TXEN
  TP47: Value: MODESEL
  TP48: Value: RBIAS
  TP49: Value: PHY_PWRDN
  TP50: Value: VDDA3V3
  TP51: Value: PHY_nRST
  TP52: Value: VDDIO
  TP53: Value: Strap6
  TP54: Value: EMAC_OSC_CLK
  TP55: Value: 50MHz IN EMAC
  TP56: Value: 50MHz OUT EMAC
U5 = IC_DP83826ERHBR: Ethernet Controller 10/100 Base-T/TX PHY MII, RMII Interface 32-VQFN (5x5); Manufacturer: Texas Instruments; Supplier 1: Mouser; Manufacturer Part Number: DP83826ERHBR; RoHS: Yes; Category: Ethernet Interface ICs; Stock 1: 398; Pricing 1: 1=3.53000, 10=3.18000, 50=3.00000, 100=2.61000, 1000=1.94000, 10000=1.93000 (USD); Supplier Part Number 1: 595-DP83826ERHBR; ComponentLink2Description: Datasheet; ComponentLink2URL: C:\Users\Public\Documents\Altium\Projects\Cellar_Watchdog\Docs\Ethernet\dp83826e.pdf; ComponentLink3Description: Design Layout; ComponentLink3URL: C:\Users\Public\Documents\Altium\Projects\Cellar_Watchdog\Docs\Ethernet\snla387.pdf
Y3 = XTAL_50.000MHz-10pF_4-SMD: 50 MHz ±15ppm Crystal 10pF 40 Ohms 4-SMD, No Lead; Manufacturer: ECS International; Frequency Stability: 20ppm; ESR (Equivalent Series Resistance): 40R; Supplier 1: Digi-Key; Manufacturer Part Number: ECS-500-10-33-RTN-TR; RoHS: Yes; Stock 1: 1111; Pricing 1: 1=0.56000, 10=0.46700, 50=0.42040, 100=0.37370, 500=0.35502 (USD); Mounting Technology: Surface Mount; Case/Package: SMD/SMT; Min Operating Temperature: -40°C; Max Operating Temperature: 85°C; Packaging: Tape and Reel; Frequency Tolerance: 15ppm; Load Capacitance: 10pF; RoHS Compliant: No; ComponentLink1URL: C:\Users\Public\Documents\Altium\Projects\Cellar_Watchdog\Docs\Crystal\ecx-32.pdf; ComponentLink1Description: Datasheet; Supplier 2: Mouser; Supplier Part Number 2: 520-500-10-33-RTNT; Supplier Part Number 1: XC2551CT-ND

## Sheet Power Budget.SchDoc: Power Budget
size A4; Date: Dec. 28th, 2022; Author: Karl Asseily; DrawnBy: Karl Asseily; DocumentNumber: 202301161053; Revision: 1.2; SheetNumber: 3; SheetTotal: 20
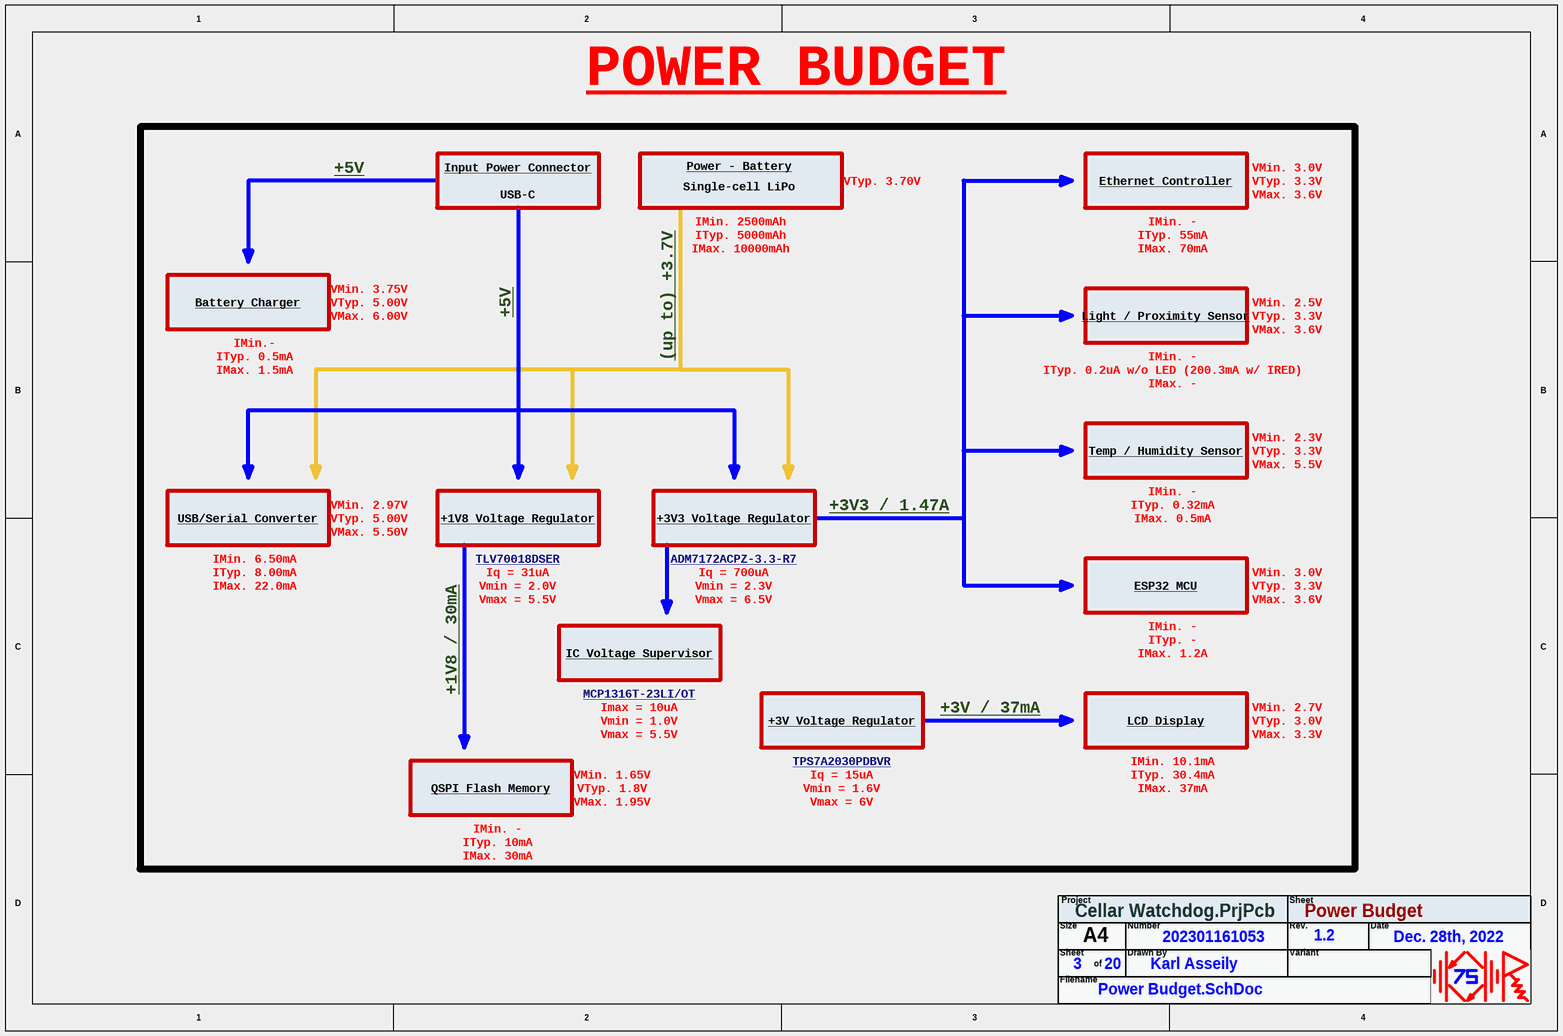
[diagram p19: Power Budget.SchDoc]

### Notes on the sheet
- POWER BUDGET
- +5V
- Input Power Connector
- Power - Battery
- Single-cell LiPo
- VTyp. 3.70V
- Ethernet Controller
- VMin. 3.0V
- VTyp. 3.3V
- USB-C
- IMin. 2500mAh
- ITyp. 5000mAh
- IMax. 10000mAh
- IMin. -
- ITyp. 55mA
- IMax. 70mA
- VMax. 3.6V
- Battery Charger
- VMin. 3.75V
- VTyp. 5.00V
- VMax. 6.00V
- (up to) +3.7V
- Light / Proximity Sensor
- VMin. 2.5V
- IMin.-
- ITyp. 0.5mA
- IMax. 1.5mA
- ITyp. 0.2uA w/o LED (200.3mA w/ IRED)
- IMax. -
- Temp / Humidity Sensor
- VMin. 2.3V
- USB/Serial Converter
- VMin. 2.97V
- +1V8 Voltage Regulator
- +3V3 Voltage Regulator
- +3V3 / 1.47A
- ITyp. 0.32mA
- IMax. 0.5mA
- VMax. 5.5V
- IMin. 6.50mA
- ITyp. 8.00mA
- IMax. 22.0mA
- VMax. 5.50V
- TLV70018DSER <https://www.digikey.com/en/products/detail/texas-instruments/TLV70018DSER/2232569>
- Iq = 31uA
- Vmin = 2.0V
- ADM7172ACPZ-3.3-R7 <https://www.digikey.com/en/products/detail/analog-devices-inc/ADM7172ACPZ-3-3-R7/5011546?s=N4IgTCBcDaIIIBECyB2AjCscDCAFAWgLQDMAdMYQEoogC6AvkA>
- Iq = 700uA
- Vmin = 2.3V
- ESP32 MCU
- +1V8 / 30mA
- Vmax = 5.5V
- IC Voltage Supervisor
- Vmax = 6.5V
- ITyp. -
- IMax. 1.2A
- Imax = 10uA
- Vmin = 1.0V
- MCP1316T-23LI/OT <https://www.digikey.com/en/products/detail/microchip-technology/MCP1316T-23LI-OT/6244321>
- +3V Voltage Regulator
- +3V / 37mA
- LCD Display
- VMin. 2.7V
- VTyp. 3.0V
- QSPI Flash Memory
- VMin. 1.65V
- VTyp. 1.8V
- TPS7A2030PDBVR <https://www.digikey.com/en/products/detail/texas-instruments/TPS7A2030PDBVR/13566871?s=N4IgTCBcDaICoAUDKB2AgmADAZkwgIgEIBqASiALoC%2BQA>
- Iq = 15uA
- Vmin = 1.6V
- IMin. 10.1mA
- ITyp. 30.4mA
- IMax. 37mA
- VMax. 3.3V
- ITyp. 10mA
- IMax. 30mA
- VMax. 1.95V
- Vmax = 6V
- Project
- Sheet
- Size
- Filename
- A4
- of
- Number
- Drawn By
- Rev.
- Variant
- Date

## Nets that join several sheets
+1V8: Flash Memory (6 pins), Voltage Regulators (C10.1 TP17.TP VR2.3)
+3V: Voltage Regulators (C12.1 TP18.TP VR3.5), LCD Display (DS1.12 DS1.A R42.2)
+3V3: ESP32 Processor (18 pins), Voltage Supervisor (C34.1 R28.2 VR4.5), Voltage Regulators (5 pins), Light and Proximity Sensor (7 pins), Temp and Humidity Sensor (C62.1 R46.2 R47.2 U7.3), Ethernet Controller (7 pins)
GND: RF Antenna (L2.2 TP36.3 TP36.4), Flash Memory (5 pins), ESP32 Processor (15 pins), CPU Clock (C30.2 C31.2 Y1.2 Y1.4), RTC Clock (C36.2 C37.2), Voltage Supervisor (C34.2 C35.2 S3.2 VR4.2), USB-to-Serial Converter (6 pins), USB-C Connector (10 pins), Voltage Regulators (14 pins), Battery Charger (12 pins), LCD Display (8 pins), Light and Proximity Sensor (C60.2 C61.2 U6.1), Temp and Humidity Sensor (C62.2 U7.4), Ethernet Controller (29 pins)
V_BATT: Voltage Regulators (Q1.1 Q1.2 Q1.5 Q1.6), Battery Charger (6 pins)
V_USB: USB-to-Serial Converter (C13.1 R9.2 R10.2 U2.4), Main Power Switch (S1.1a), Voltage Regulators (Q1.3 R8.1), Battery Charger (6 pins)
VUSB_RAW: USB-C Connector (FB1.2), Main Power Switch (S1.1 TP1.TP)
32K_IN: ESP32 Processor (U3.12), RTC Clock (C36.1 R30.1 TP37.TP Y2.1)
32K_OUT: ESP32 Processor (U3.13), RTC Clock (C37.1 R30.2 TP38.TP Y2.2)
EMAC_MDC: ESP32 Processor (U3.24), Ethernet Controller (TP39.TP U5.12)
EMAC_MDIO: ESP32 Processor (U3.34), Ethernet Controller (R32.1 TP40.TP U5.11)
EMAC_OSC_CLK: ESP32 Processor (R22.1 S2.1 S2.2 U3.23), Ethernet Controller (R41.1 TP54.TP)
EMAC_RX_DV: ESP32 Processor (U3.16), Ethernet Controller (TP43.TP U5.18)
EMAC_RXD0: ESP32 Processor (U3.14), Ethernet Controller (TP42.TP U5.16)
EMAC_RXD1: ESP32 Processor (U3.15), Ethernet Controller (TP41.TP U5.15)
EMAC_TXD0: ESP32 Processor (U3.38), Ethernet Controller (TP45.TP U5.24)
EMAC_TXD1: ESP32 Processor (U3.39), Ethernet Controller (TP44.TP U5.25)
EMAC_TXEN: ESP32 Processor (U3.42), Ethernet Controller (TP46.TP U5.23)
FLASH_SPICLK: Flash Memory (R27.1 TP32.TP U4.6), ESP32 Processor (R19.1)
FLASH_SPICS0: Flash Memory (R24.1 TP28.TP U4.1), ESP32 Processor (R17.1)
FLASH_SPID: Flash Memory (TP33.TP U4.5), ESP32 Processor (R21.1)
FLASH_SPIHD: Flash Memory (R26.1 TP31.TP U4.7), ESP32 Processor (R15.1)
FLASH_SPIQ: Flash Memory (TP29.TP U4.2), ESP32 Processor (R20.1)
FLASH_SPIWP: Flash Memory (R25.1 TP30.TP U4.3), ESP32 Processor (R16.1)
LCD_MISO: ESP32 Processor (U3.18), LCD Display (DS1.15 TP59.TP)
LCD_MOSI: ESP32 Processor (U3.20), LCD Display (DS1.13 TP57.TP)
LCD_nCS1: ESP32 Processor (U3.22), LCD Display (DS1.17 TP61.TP)
LCD_nRST: ESP32 Processor (U3.21), LCD Display (DS1.16 R42.1 TP60.TP)
LCD_SCL: ESP32 Processor (U3.17), LCD Display (DS1.14 TP58.TP)
LIGHT_INT: ESP32 Processor (U3.5), Light and Proximity Sensor (R43.1 TP64.TP U6.6)
LIGHT_SCL: ESP32 Processor (U3.25), Light and Proximity Sensor (R45.1 TP62.TP U6.8)
LIGHT_SDA: ESP32 Processor (U3.27), Light and Proximity Sensor (R44.1 TP63.TP U6.7)
LNA_IN: RF Antenna (TP36.2), ESP32 Processor (U3.2)
MCU_nRST: ESP32 Processor (U3.9), Voltage Supervisor (C35.1 R28.1 TP34.TP VR4.1)
TEMP_SCL: ESP32 Processor (U3.35), Temp and Humidity Sensor (R46.1 TP67.TP U7.2)
TEMP_SDA: ESP32 Processor (U3.36), Temp and Humidity Sensor (R47.1 TP66.TP U7.1)
UART_RXD: ESP32 Processor (R23.1), USB-to-Serial Converter (R10.1 TP20.TP U2.10)
UART_TXD: ESP32 Processor (U3.40), USB-to-Serial Converter (R9.1 TP19.TP U2.7)
USB_N: USB-to-Serial Converter (C15.1 R11.2), USB-C Connector (5 pins)
USB_P: USB-to-Serial Converter (C16.1 R13.2), USB-C Connector (5 pins)
XTAL_IN_R: ESP32 Processor (R18.2), CPU Clock (C30.1 TP26.TP Y1.1)
XTAL_OUT: ESP32 Processor (U3.44), CPU Clock (C31.1 TP27.TP Y1.3)